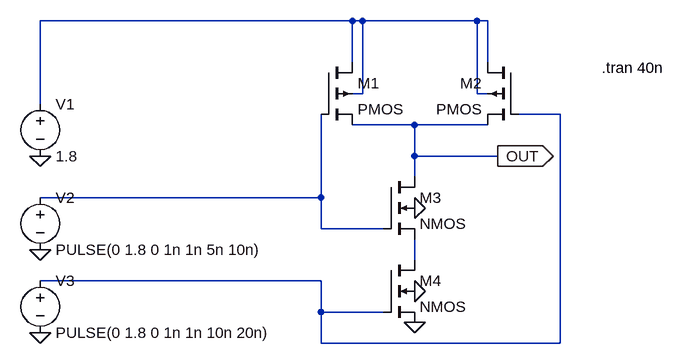
[diagram p0: schematic tb_NAND.asc]
tb_NAND.asc, the LTspice schematic file:
Version 4.1
SHEET 1 880 680
WIRE 272 0 -208 0
WIRE 288 0 272 0
WIRE 464 0 288 0
WIRE 480 0 464 0
WIRE 272 64 272 0
WIRE 480 64 480 0
WIRE 288 112 288 0
WIRE 288 112 272 112
WIRE 464 112 464 0
WIRE 480 112 464 112
WIRE -208 128 -208 0
WIRE 592 144 528 144
WIRE 368 160 272 160
WIRE 480 160 368 160
WIRE 368 208 368 160
WIRE 496 208 368 208
WIRE 368 240 368 208
WIRE 224 272 224 144
WIRE 224 272 -208 272
WIRE 224 320 224 272
WIRE 320 320 224 320
WIRE 368 368 368 336
WIRE 224 400 -208 400
WIRE 224 448 224 400
WIRE 320 448 224 448
WIRE 224 496 224 448
WIRE 592 496 592 144
WIRE 592 496 224 496
FLAG -208 480 0
FLAG -208 352 0
FLAG -208 208 0
FLAG 368 464 0
FLAG 496 208 OUT
IOPIN 496 208 Out
FLAG 368 288 0
FLAG 368 416 0
SYMBOL pmos4 224 64 R0
SYMATTR InstName M1
SYMBOL pmos4 528 64 M0
SYMATTR InstName M2
SYMBOL nmos4 320 240 R0
SYMATTR InstName M3
SYMBOL nmos4 320 368 R0
SYMATTR InstName M4
SYMBOL voltage -208 112 R0
WINDOW 123 0 0 Left 0
WINDOW 39 0 0 Left 0
SYMATTR InstName V1
SYMATTR Value 1.8
SYMBOL voltage -208 256 R0
WINDOW 123 0 0 Left 0
WINDOW 39 0 0 Left 0
SYMATTR InstName V2
SYMATTR Value PULSE(0 1.8 0 1n 1n 5n 10n)
SYMBOL voltage -208 384 R0
WINDOW 123 0 0 Left 0
WINDOW 39 0 0 Left 0
SYMATTR InstName V3
SYMATTR Value PULSE(0 1.8 0 1n 1n 10n 20n)
TEXT 656 72 Left 2 !.tran 40n

The netlist it stands for:
* tb_NAND.asc
M1 N001 N003 OUT N001 PMOS
M2 N001 N002 OUT N001 PMOS
M3 OUT N003 N004 0 NMOS
M4 N004 N002 0 0 NMOS
V1 N001 0 1.8
V2 N003 0 PULSE(0 1.8 0 1n 1n 5n 10n)
V3 N002 0 PULSE(0 1.8 0 1n 1n 10n 20n)
.model NMOS NMOS
.model PMOS PMOS
.lib standard.mos
.tran 40n
.backanno
.end